# Altium schematic sheet GCM155R71H103KA55D.schdoc
size 127 x 101 mm
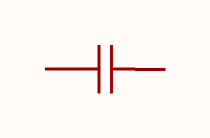
[diagram p0: GCM155R71H103KA55D.schdoc]

## Parts
C?  gcm155r71h103ka55d  [C0402]  (value not drawn)

## Nets

Not connected (* = marked no-connect by the designer): C? 1 2

## Library data of the parts
C? = gcm155r71h103ka55d: 容值:10nF;精度:±10%;额定电压:50V;温度系数:X7R;; Manufacturer: muRata(村田); AddInBom: yes; ModelId: 36a51122f27c49738f86b3bfa98863e0; ModelName: C0402_L1.0-W0.5-H0.5; ModelTransform: 39.37,19.685,0,0,0,0,0,0,0; Value: 10nF; Tolerance: ±10%; Voltage Rating: 50V; Temperature Coefficient: X7R; Symbol: GCM155R71H103KA55D; LCSC Part Name: 10nF ±10% 50V; SupplierPart: C91601; ManufacturerPart: GCM155R71H103KA55D; Supplier Footprint: 0402; JLCPCB Part Class: Extended Part; Datasheet: https://item.szlcsc.com/datasheet/GCM155R71H103KA55D/92790.html; Supplier: LCSC; ConvertToPcb: yes; FootprintName: C0402